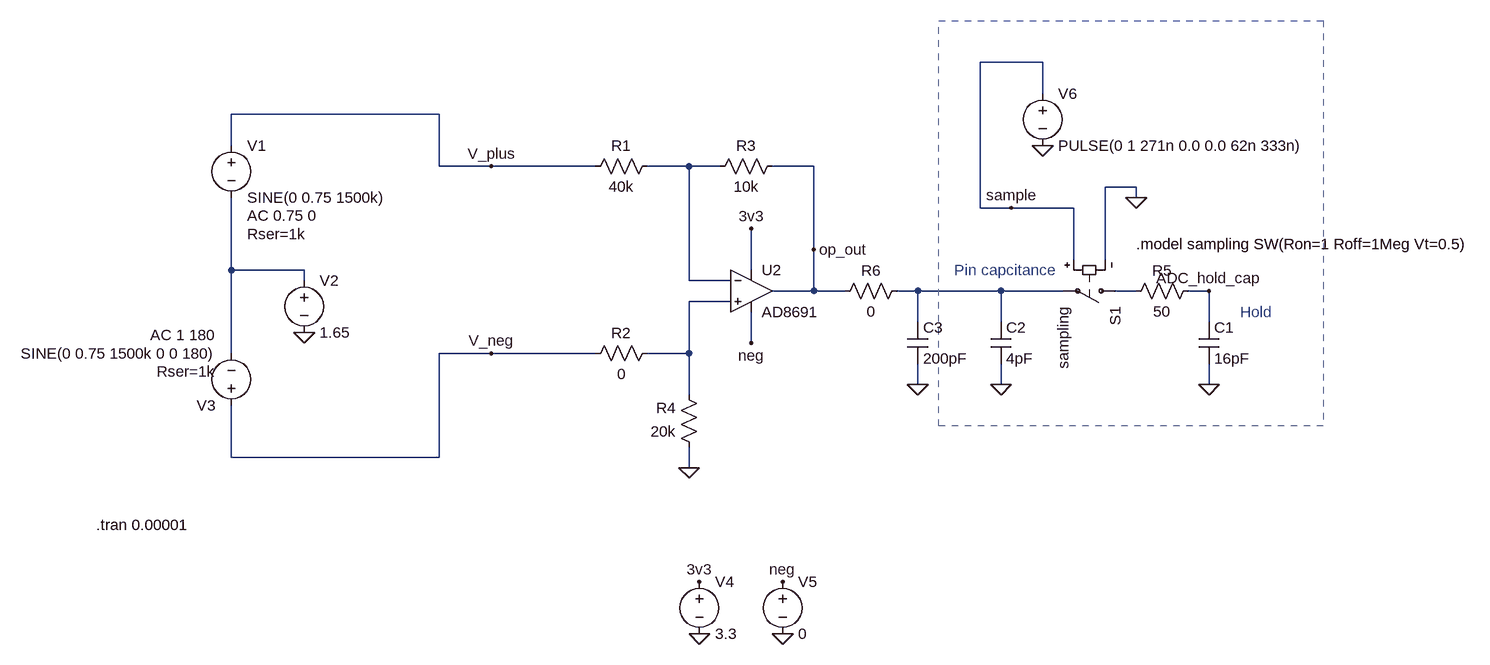
[diagram p0: schematic differential_amp_and_pseudo_diff_input.asc]
differential_amp_and_pseudo_diff_input.asc, the LTspice schematic file:
Version 4
SHEET 1 1488 776
WIRE 784 -160 688 -160
WIRE 784 -112 784 -160
WIRE -144 -80 -464 -80
WIRE -464 -32 -464 -80
WIRE -144 0 -144 -80
WIRE -64 0 -144 0
WIRE 96 0 -64 0
WIRE 240 0 176 0
WIRE 288 0 240 0
WIRE 432 0 368 0
WIRE 928 32 880 32
WIRE 928 48 928 32
WIRE 688 64 688 -160
WIRE 736 64 688 64
WIRE 832 64 736 64
WIRE 432 128 432 0
WIRE 832 144 832 64
WIRE 880 144 880 32
WIRE -464 160 -464 48
WIRE -352 160 -464 160
WIRE 336 160 336 96
WIRE -352 176 -352 160
WIRE 240 176 240 0
WIRE 304 176 240 176
WIRE 432 192 432 128
WIRE 432 192 368 192
WIRE 480 192 432 192
WIRE 592 192 560 192
WIRE 720 192 592 192
WIRE 816 192 720 192
WIRE 928 192 896 192
WIRE 1040 192 1008 192
WIRE 304 208 240 208
WIRE 592 240 592 192
WIRE 720 240 720 192
WIRE 1040 240 1040 192
WIRE 336 272 336 224
WIRE -464 288 -464 160
WIRE -64 288 -144 288
WIRE 96 288 -64 288
WIRE 240 288 240 208
WIRE 240 288 176 288
WIRE 592 336 592 304
WIRE 720 336 720 304
WIRE 1040 336 1040 304
WIRE 240 352 240 288
WIRE -464 448 -464 368
WIRE -144 448 -144 288
WIRE -144 448 -464 448
WIRE 240 464 240 432
FLAG -352 256 0
FLAG 240 464 0
FLAG 256 640 3v3
FLAG 256 720 0
FLAG 336 96 3v3
FLAG 384 640 neg
FLAG 384 720 0
FLAG 336 272 neg
FLAG 1040 336 0
FLAG 720 336 0
FLAG 928 48 0
FLAG 784 -32 0
FLAG 592 336 0
FLAG -64 0 V_plus
FLAG -64 288 V_neg
FLAG 432 128 op_out
FLAG 1040 192 ADC_hold_cap
FLAG 736 64 sample
SYMBOL voltage -464 -48 R0
WINDOW 123 24 124 Left 2
WINDOW 39 24 152 Left 2
SYMATTR Value2 AC 0.75 0
SYMATTR SpiceLine Rser=1k
SYMATTR InstName V1
SYMATTR Value SINE(0 0.75 1500k)
SYMBOL voltage -352 160 R0
WINDOW 123 0 0 Left 0
WINDOW 39 0 0 Left 0
SYMATTR InstName V2
SYMATTR Value 1.65
SYMBOL voltage -464 384 R180
WINDOW 123 24 124 Left 2
WINDOW 39 24 68 Left 2
SYMATTR Value2 AC 1 180
SYMATTR SpiceLine Rser=1k
SYMATTR InstName V3
SYMATTR Value SINE(0 0.75 1500k 0 0 180)
SYMBOL res 192 -16 R90
WINDOW 0 0 56 VBottom 2
WINDOW 3 32 56 VTop 2
SYMATTR InstName R1
SYMATTR Value 40k
SYMBOL res 192 272 R90
WINDOW 0 0 56 VBottom 2
WINDOW 3 32 56 VTop 2
SYMATTR InstName R2
SYMATTR Value 0
SYMBOL res 384 -16 R90
WINDOW 0 0 56 VBottom 2
WINDOW 3 32 56 VTop 2
SYMATTR InstName R3
SYMATTR Value 10k
SYMBOL res 256 448 R180
WINDOW 0 36 76 Left 2
WINDOW 3 36 40 Left 2
SYMATTR InstName R4
SYMATTR Value 20k
SYMBOL voltage 256 624 R0
WINDOW 123 0 0 Left 0
WINDOW 39 0 0 Left 0
SYMATTR InstName V4
SYMATTR Value 3.3
SYMBOL voltage 384 624 R0
WINDOW 123 0 0 Left 0
WINDOW 39 0 0 Left 0
SYMATTR InstName V5
SYMATTR Value 0
SYMBOL OpAmps\\AD8691 336 128 R0
SYMATTR InstName U2
SYMBOL cap 1024 240 R0
SYMATTR InstName C1
SYMATTR Value 16pF
SYMBOL res 1024 176 R90
WINDOW 0 0 56 VBottom 2
WINDOW 3 32 56 VTop 2
SYMATTR InstName R5
SYMATTR Value 50
SYMBOL cap 704 240 R0
SYMATTR InstName C2
SYMATTR Value 4pF
SYMBOL res 576 176 R90
WINDOW 0 0 56 VBottom 2
WINDOW 3 32 56 VTop 2
SYMATTR InstName R6
SYMATTR Value 0
SYMBOL sw 912 192 R90
SYMATTR InstName S1
SYMATTR Value sampling
SYMBOL voltage 784 -128 R0
WINDOW 123 0 0 Left 0
WINDOW 39 0 0 Left 0
SYMATTR InstName V6
SYMATTR Value PULSE(0 1 271n 0.0 0.0 62n 333n)
SYMBOL cap 576 240 R0
SYMATTR InstName C3
SYMATTR Value 200pF
TEXT -672 552 Left 2 !.tran 0.00001
TEXT 648 160 Left 2 ;Pin capcitance
TEXT 1088 224 Left 2 ;Hold
TEXT 928 120 Left 2 !.model sampling SW(Ron=1 Roff=1Meg Vt=0.5)
RECTANGLE Normal 1216 400 624 -224 2

The netlist it stands for:
* differential_amp_and_pseudo_diff_input.asc
V1 V_plus N002 SINE(0 0.75 1500k) AC 0.75 0 Rser=1k
V2 N002 0 1.65
V3 V_neg N002 SINE(0 0.75 1500k 0 0 180) AC 1 180 Rser=1k
R1 N001 V_plus 40k
R2 N005 V_neg 0
R3 op_out N001 10k
R4 0 N005 20k
V4 3v3 0 3.3
V5 neg 0 0
XU2 N005 N001 3v3 neg op_out AD8691  ; pins In+ In- V+ V- OUT
C1 ADC_hold_cap 0 16pF
R5 ADC_hold_cap N004 50
C2 N003 0 4pF
R6 N003 op_out 0
S1 N004 N003 sample 0 sampling
V6 sample 0 PULSE(0 1 271n 0.0 0.0 62n 333n)
C3 N003 0 200pF
.tran 0.00001
* Pin capcitance
* Hold
.model sampling SW(Ron=1 Roff=1Meg Vt=0.5)
.backanno
.end